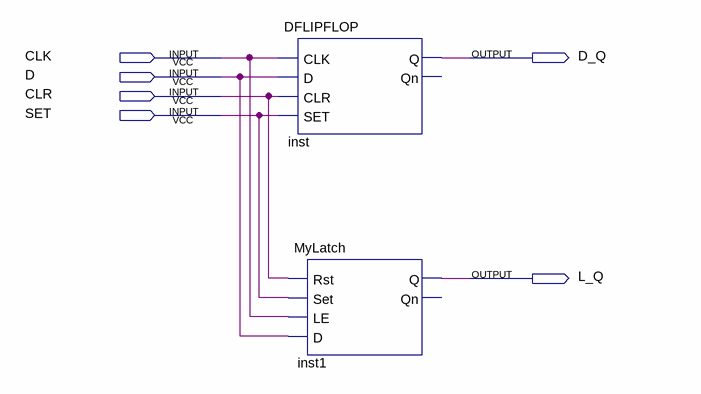
[diagram p0: schematic sheet]
// Quartus schematic DFF_LATCH.bdf as structural Verilog: 2 symbols, 6 pins
module DFF_LATCH (
  input  CLK,
  input  D,
  input  CLR,
  input  SET,
  output D_Q,
  output L_Q
);

  DFLIPFLOP inst (.CLK(CLK), .D(D), .CLR(CLR), .SET(SET), .Q(D_Q));  // open: Qn
  MyLatch inst1 (.Rst(CLR), .Set(SET), .LE(CLK), .D(D), .Q(L_Q));  // open: Qn
endmodule
